# Altium schematic sheet Sheet4.SchDoc: RBCM_Mother
size 419 x 297 mm; SheetNumber: 3; SheetTotal: 3
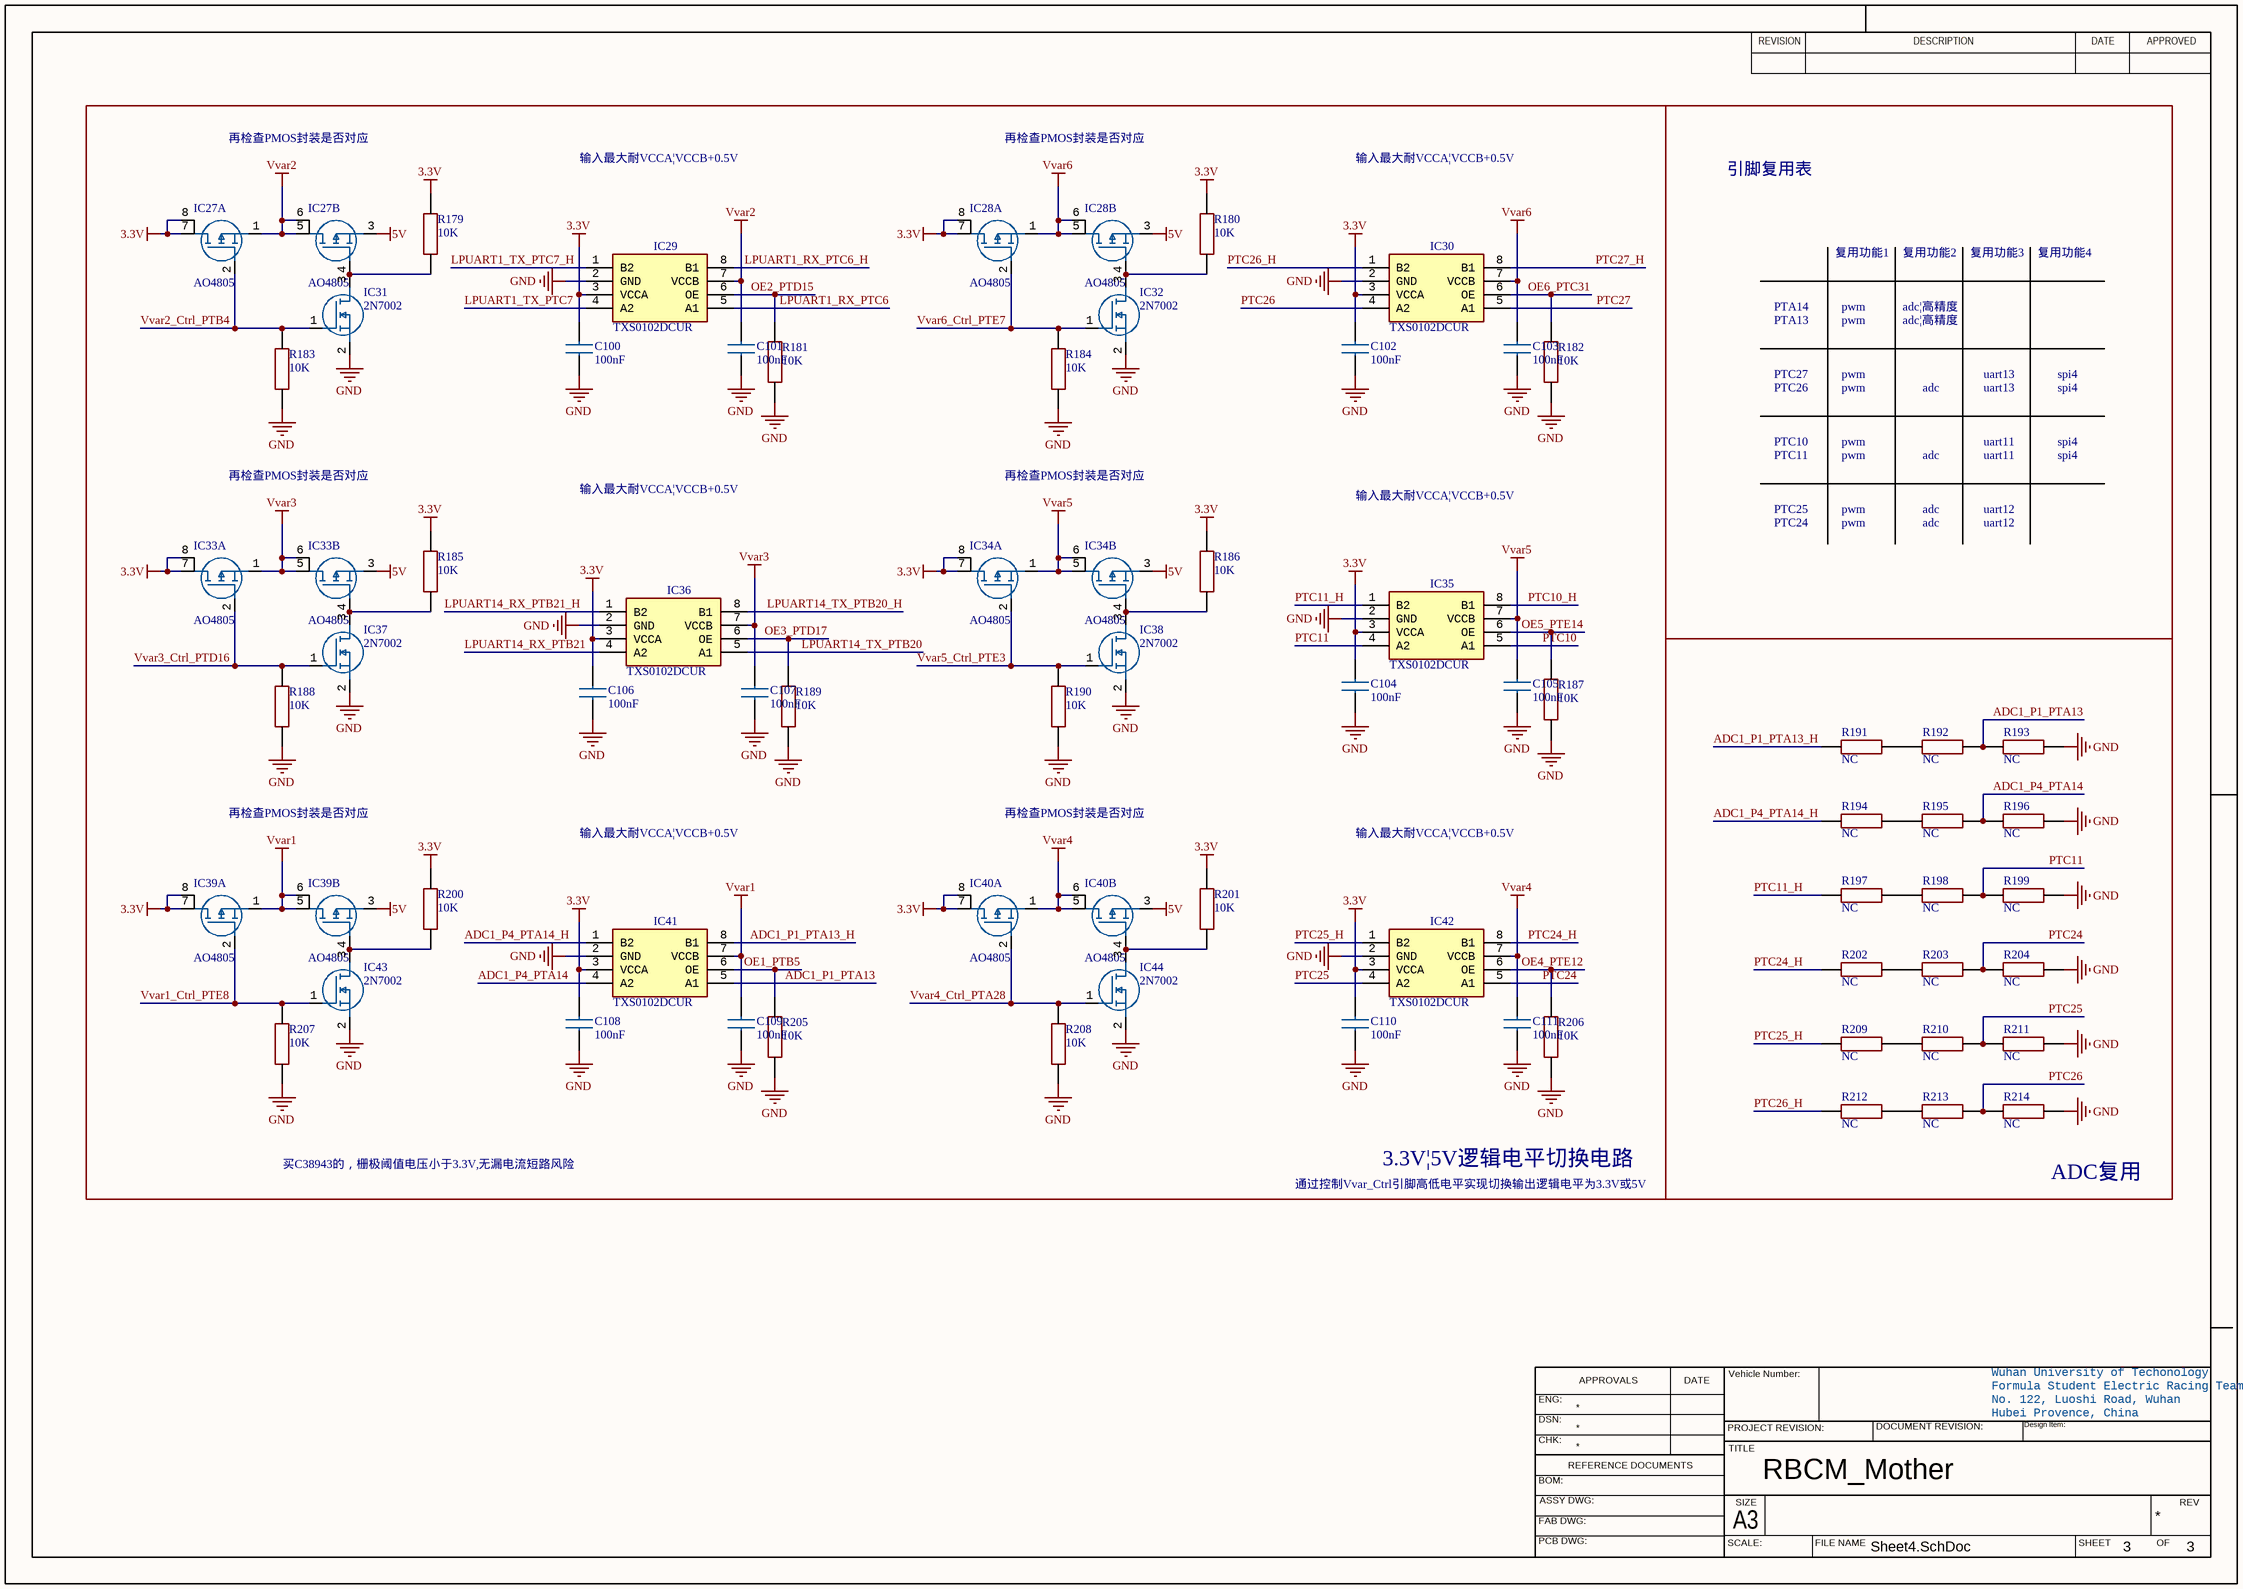
[diagram p0: Sheet4.SchDoc]

## Parts
C100  100nF  [CAPC1608X90N]
C101  100nF  [CAPC1608X90N]
C102  100nF  [CAPC1608X90N]
C103  100nF  [CAPC1608X90N]
C104  100nF  [CAPC1608X90N]
C105  100nF  [CAPC1608X90N]
C106  100nF  [CAPC1608X90N]
C107  100nF  [CAPC1608X90N]
C108  100nF  [CAPC1608X90N]
C109  100nF  [CAPC1608X90N]
C110  100nF  [CAPC1608X90N]
C111  100nF  [CAPC1608X90N]
IC27  AO4805  [SOIC127P600X175-8N_AO4805]  (parts A,B of 2)
IC28  AO4805  [SOIC127P600X175-8N_AO4805]  (parts A,B of 2)
IC29  TXS0102DCUR  [SOP50P310X90-8N]
IC30  TXS0102DCUR  [SOP50P310X90-8N]
IC31  2N7002  [SOT95P230X110-3N]
IC32  2N7002  [SOT95P230X110-3N]
IC33  AO4805  [SOIC127P600X175-8N_AO4805]  (parts A,B of 2)
IC34  AO4805  [SOIC127P600X175-8N_AO4805]  (parts A,B of 2)
IC35  TXS0102DCUR  [SOP50P310X90-8N]
IC36  TXS0102DCUR  [SOP50P310X90-8N]
IC37  2N7002  [SOT95P230X110-3N]
IC38  2N7002  [SOT95P230X110-3N]
IC39  AO4805  [SOIC127P600X175-8N_AO4805]  (parts A,B of 2)
IC40  AO4805  [SOIC127P600X175-8N_AO4805]  (parts A,B of 2)
IC41  TXS0102DCUR  [SOP50P310X90-8N]
IC42  TXS0102DCUR  [SOP50P310X90-8N]
IC43  2N7002  [SOT95P230X110-3N]
IC44  2N7002  [SOT95P230X110-3N]
R179  10K  [RESC1608X55N]
R180  10K  [RESC1608X55N]
R181  10K  [RESC1608X55N]
R182  10K  [RESC1608X55N]
R183  10K  [RESC1608X55N]
R184  10K  [RESC1608X55N]
R185  10K  [RESC1608X55N]
R186  10K  [RESC1608X55N]
R187  10K  [RESC1608X55N]
R188  10K  [RESC1608X55N]
R189  10K  [RESC1608X55N]
R190  10K  [RESC1608X55N]
R191  NC  [RESC1608X55N]
R192  NC  [RESC1608X55N]
R193  NC  [RESC1608X55N]
R194  NC  [RESC1608X55N]
R195  NC  [RESC1608X55N]
R196  NC  [RESC1608X55N]
R197  NC  [RESC1608X55N]
R198  NC  [RESC1608X55N]
R199  NC  [RESC1608X55N]
R200  10K  [RESC1608X55N]
R201  10K  [RESC1608X55N]
R202  NC  [RESC1608X55N]
R203  NC  [RESC1608X55N]
R204  NC  [RESC1608X55N]
R205  10K  [RESC1608X55N]
R206  10K  [RESC1608X55N]
R207  10K  [RESC1608X55N]
R208  10K  [RESC1608X55N]
R209  NC  [RESC1608X55N]
R210  NC  [RESC1608X55N]
R211  NC  [RESC1608X55N]
R212  NC  [RESC1608X55N]
R213  NC  [RESC1608X55N]
R214  NC  [RESC1608X55N]

## Blocks framed on the sheet
3.3V|5V逻辑电平切换电路: C100-C111 IC27-IC44 R179-R190 R200 R201 R205-R208
ADC复用: R191-R199 R202-R204 R209-R214

## Nets
3.3V: C100.1 C102.1 C104.1 C106.1 C108.1 C110.1 IC27.7(D2) IC27.8(D2) IC28.7(D2) IC28.8(D2) IC29.3(VCCA) IC30.3(VCCA) IC33.7(D2) IC33.8(D2) IC34.7(D2) IC34.8(D2) IC35.3(VCCA) IC36.3(VCCA) IC39.7(D2) IC39.8(D2) IC40.7(D2) IC40.8(D2) IC41.3(VCCA) IC42.3(VCCA) R179.1 R180.1 R185.1 R186.1 R200.1 R201.1
5V: IC27.3(S1) IC28.3(S1) IC33.3(S1) IC34.3(S1) IC39.3(S1) IC40.3(S1)
GND: C100.2 C101.2 C102.2 C103.2 C104.2 C105.2 C106.2 C107.2 C108.2 C109.2 C110.2 C111.2 IC29.2(GND) IC30.2(GND) IC31.2(S) IC32.2(S) IC35.2(GND) IC36.2(GND) IC37.2(S) IC38.2(S) IC41.2(GND) IC42.2(GND) IC43.2(S) IC44.2(S) R181.2 R182.2 R183.2 R184.2 R187.2 R188.2 R189.2 R190.2 R193.2 R196.2 R199.2 R204.2 R205.2 R206.2 R207.2 R208.2 R211.2 R214.2
Vvar1: C109.1 IC39.1(S2) IC39.5(D1) IC39.6(D1) IC41.7(VCCB)
Vvar2: C101.1 IC27.1(S2) IC27.5(D1) IC27.6(D1) IC29.7(VCCB)
Vvar3: C107.1 IC33.1(S2) IC33.5(D1) IC33.6(D1) IC36.7(VCCB)
Vvar4: C111.1 IC40.1(S2) IC40.5(D1) IC40.6(D1) IC42.7(VCCB)
Vvar5: C105.1 IC34.1(S2) IC34.5(D1) IC34.6(D1) IC35.7(VCCB)
Vvar6: C103.1 IC28.1(S2) IC28.5(D1) IC28.6(D1) IC30.7(VCCB)
ADC1_P1_PTA13: IC41.5(A1) R192.2 R193.1
ADC1_P1_PTA13_H: IC41.8(B1) R191.1
ADC1_P4_PTA14: IC41.4(A2) R195.2 R196.1
ADC1_P4_PTA14_H: IC41.1(B2) R194.1
LPUART1_RX_PTC6: IC29.5(A1)
LPUART1_RX_PTC6_H: IC29.8(B1)
LPUART1_TX_PTC7: IC29.4(A2)
LPUART1_TX_PTC7_H: IC29.1(B2)
LPUART14_RX_PTB21: IC36.4(A2)
LPUART14_RX_PTB21_H: IC36.1(B2)
LPUART14_TX_PTB20: IC36.5(A1)
LPUART14_TX_PTB20_H: IC36.8(B1)
OE1_PTB5: IC41.6(OE) R205.1
OE2_PTD15: IC29.6(OE) R181.1
OE3_PTD17: IC36.6(OE) R189.1
OE4_PTE12: IC42.6(OE) R206.1
OE5_PTE14: IC35.6(OE) R187.1
OE6_PTC31: IC30.6(OE) R182.1
PTC10: IC35.5(A1)
PTC10_H: IC35.8(B1)
PTC11: IC35.4(A2) R198.2 R199.1
PTC11_H: IC35.1(B2) R197.1
PTC24: IC42.5(A1) R203.2 R204.1
PTC24_H: IC42.8(B1) R202.1
PTC25: IC42.4(A2) R210.2 R211.1
PTC25_H: IC42.1(B2) R209.1
PTC26: IC30.4(A2) R213.2 R214.1
PTC26_H: IC30.1(B2) R212.1
PTC27: IC30.5(A1)
PTC27_H: IC30.8(B1)
Vvar1_Ctrl_PTE8: IC39.2(G2) IC43.1(G) R207.1
Vvar2_Ctrl_PTB4: IC27.2(G2) IC31.1(G) R183.1
Vvar3_Ctrl_PTD16: IC33.2(G2) IC37.1(G) R188.1
Vvar4_Ctrl_PTA28: IC40.2(G2) IC44.1(G) R208.1
Vvar5_Ctrl_PTE3: IC34.2(G2) IC38.1(G) R190.1
Vvar6_Ctrl_PTE7: IC28.2(G2) IC32.1(G) R184.1
NetIC27_4: IC27.4(G1) IC31.3(D) R179.2
NetIC28_4: IC28.4(G1) IC32.3(D) R180.2
NetIC33_4: IC33.4(G1) IC37.3(D) R185.2
NetIC34_4: IC34.4(G1) IC38.3(D) R186.2
NetIC39_4: IC39.4(G1) IC43.3(D) R200.2
NetIC40_4: IC40.4(G1) IC44.3(D) R201.2
NetR191_2: R191.2 R192.1
NetR194_2: R194.2 R195.1
NetR197_2: R197.2 R198.1
NetR202_2: R202.2 R203.1
NetR209_2: R209.2 R210.1
NetR212_2: R212.2 R213.1

## Notes on the sheet
- 再检查PMOS封装是否对应
- 输入最大耐VCCA|VCCB+0.5V
- 引脚复用表
- 复用功能1
- 复用功能2
- 复用功能3
- 复用功能4
- PTA14
- PTA13
- pwm
- adc¦高精度
- PTC27
- PTC26
- adc
- uart13
- spi4
- PTC10
- PTC11
- uart11
- PTC25
- PTC24
- uart12
- 买C38943的，栅极阈值电压小于3.3V,无漏电流短路风险
- 通过控制Vvar_Ctrl引脚高低电平实现切换输出逻辑电平为3.3V或5V
- REVISION
- DESCRIPTION
- DATE
- APPROVED
- ENG:
- APPROVALS
- Vehicle Number:
- Wuhan University of Techonology
- Formula Student Electric Racing Team
- No. 122, Luoshi Road, Wuhan
- DSN:
- CHK:
- REFERENCE DOCUMENTS
- PROJECT REVISION:
- TITLE
- DOCUMENT REVISION:
- Hubei Provence, China
- Design Item:
- BOM:
- FAB DWG:
- PCB DWG:
- ASSY DWG:
- SCALE:
- A3
- SIZE
- FILE NAME
- SHEET
- OF
- REV

## Library data of the parts
C100-C111 = C0603: Capacitor CC0603KRX7R9BB104; Manufacturer_Name: YAGEO; Datasheet Link: https://componentsearchengine.com/Datasheets/2/CC0603KRX7R9BB104.pdf; Height: 0.9mm; Manufacturer_Part_Number: CC0603KRX7R9BB104; Mouser Part Number: 603-CC603KRX7R9BB104; Mouser Price/Stock: https://www.mouser.co.uk/ProductDetail/YAGEO/CC0603KRX7R9BB104?qs=vTakOoo5QyLvVCYM2ge8LQ%3D%3D; Arrow Part Number: CC0603KRX7R9BB104; Arrow Price/Stock: https://www.arrow.com/en/products/cc0603krx7r9bb104/yageo?region=europe
IC27 IC28 IC33 IC34 IC39 IC40 = AO4805: Integrated Circuit; Manufacturer_Name: Alpha & Omega Semiconductors; Datasheet Link: http://www.aosmd.com/res/data_sheets/AO4805.pdf; Height: 1.75mm; Manufacturer_Part_Number: AO4805; Arrow Part Number: AO4805; Arrow Price/Stock: https://www.arrow.com/en/products/ao4805/alpha-and-omega-semiconductor?utm_currency=USD&region=nac
IC29 IC30 IC35 IC36 IC41 IC42 = TXS0102DCUR: Integrated Circuit; Manufacturer_Name: Texas Instruments; Datasheet Link: https://datasheet.datasheetarchive.com/originals/distributors/SFDatasheet-7/sf-000145437.pdf; Height: 0.9mm; Manufacturer_Part_Number: TXS0102DCUR; Mouser Part Number: 595-TXS0102DCUR; Mouser Price/Stock: https://www.mouser.co.uk/ProductDetail/Texas-Instruments/TXS0102DCUR?qs=dB0LedT%252BmmBcQ3I%2Fs9XEDA%3D%3D; Arrow Part Number: TXS0102DCUR; Arrow Price/Stock: https://www.arrow.com/en/products/txs0102dcur/texas-instruments?utm_currency=USD&region=nac
IC31 IC32 IC37 IC38 IC43 IC44 = 2N7002: Integrated Circuit; Manufacturer_Name: Nylofix; Manufacturer_Part_Number: 2N7002P,235; Datasheet Link: https://4donline.ihs.com/images/VipMasterIC/IC/PHGL/PHGLS21946/PHGLS21946-1.pdf?hkey=EF798316E3902B6ED9A73243A3159BB0; Height: 1.1mm
R179 R180 R183-R186 R188 R190-R204 R207-R214 = R0603: Resistor; Manufacturer_Name: UNI-ROYAL(Uniroyal Elec); Manufacturer_Part_Number: 0603WAF1002T5E; Datasheet Link: https://datasheet.lcsc.com/szlcsc/Uniroyal-Elec-0603WAF1002T5E_C25804.pdf; Height: 0.55mm
R181 R182 R187 R189 R205 R206 = R0603: Resistor 0603WAF1002T5E; Manufacturer_Name: UNI-ROYAL(Uniroyal Elec); Datasheet Link: https://datasheet.lcsc.com/szlcsc/Uniroyal-Elec-0603WAF1002T5E_C25804.pdf; Height: 0.55mm; Manufacturer_Part_Number: 0603WAF1002T5E